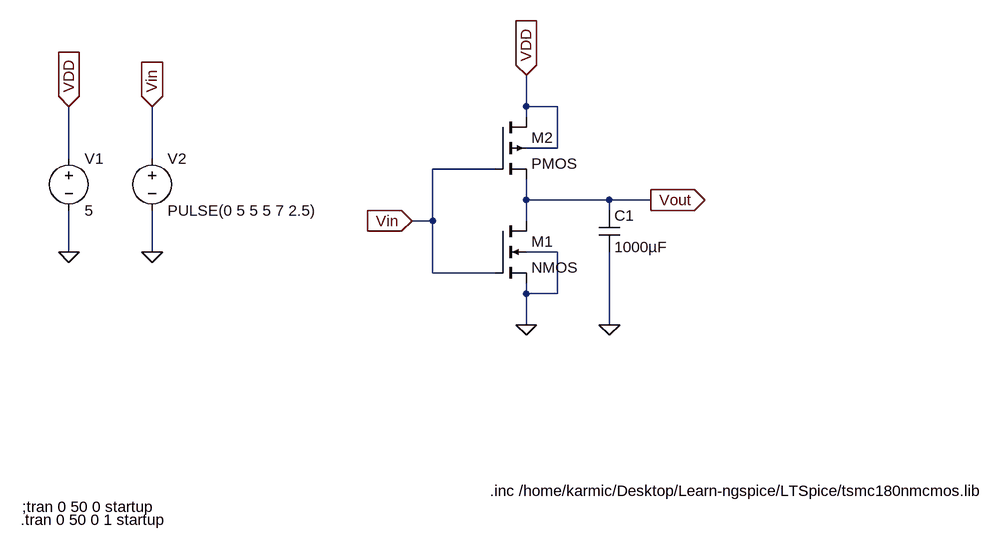
[diagram p0: schematic Inverter.asc]
Inverter.asc, the LTspice schematic file:
Version 4
SHEET 1 1096 680
WIRE 304 -64 304 -112
WIRE 352 -64 304 -64
WIRE 304 -48 304 -64
WIRE 352 0 352 -64
WIRE 352 0 304 0
WIRE -400 16 -400 -64
WIRE -272 16 -272 -64
WIRE 256 32 160 32
WIRE 304 80 304 48
WIRE 432 80 304 80
WIRE 496 80 432 80
WIRE 432 96 432 80
WIRE 160 112 160 32
WIRE 160 112 128 112
WIRE 304 112 304 80
WIRE -400 160 -400 96
WIRE -272 160 -272 96
WIRE 352 160 304 160
WIRE 160 192 160 112
WIRE 256 192 160 192
WIRE 304 224 304 208
WIRE 352 224 352 160
WIRE 352 224 304 224
WIRE 304 272 304 224
WIRE 432 272 432 160
FLAG 304 272 0
FLAG 304 -112 VDD
IOPIN 304 -112 In
FLAG 128 112 Vin
IOPIN 128 112 In
FLAG 432 272 0
FLAG 496 80 Vout
IOPIN 496 80 Out
FLAG -272 160 0
FLAG -400 -64 VDD
IOPIN -400 -64 In
FLAG -272 -64 Vin
IOPIN -272 -64 In
FLAG -400 160 0
SYMBOL nmos4 256 112 R0
SYMATTR InstName M1
SYMBOL pmos4 256 -48 R0
SYMATTR InstName M2
SYMBOL cap 416 96 R0
SYMATTR InstName C1
SYMATTR Value 1000µF
SYMBOL voltage -400 0 R0
WINDOW 123 0 0 Left 0
WINDOW 39 0 0 Left 0
SYMATTR InstName V1
SYMATTR Value 5
SYMBOL voltage -272 0 R0
WINDOW 123 0 0 Left 0
WINDOW 39 0 0 Left 0
SYMATTR InstName V2
SYMATTR Value PULSE(0 5 5 5 7 2.5)
TEXT 248 528 Left 2 !.inc /home/karmic/Desktop/Learn-ngspice/LTSpice/tsmc180nmcmos.lib
TEXT -472 552 Left 2 !;tran 0 50 0 startup
TEXT -474 572 Left 2 !.tran 0 50 0 1 startup

The netlist it stands for:
* Inverter.asc
M1 Vout Vin 0 0 NMOS
M2 VDD Vin Vout VDD PMOS
C1 Vout 0 1000µF
V1 VDD 0 5
V2 Vin 0 PULSE(0 5 5 5 7 2.5)
.model NMOS NMOS
.model PMOS PMOS
.lib standard.mos
.inc /home/karmic/Desktop/Learn-ngspice/LTSpice/tsmc180nmcmos.lib
;tran 0 50 0 startup
.tran 0 50 0 1 startup
.backanno
.end

* Results of the author's LTspice run, read from the files saved beside the schematic
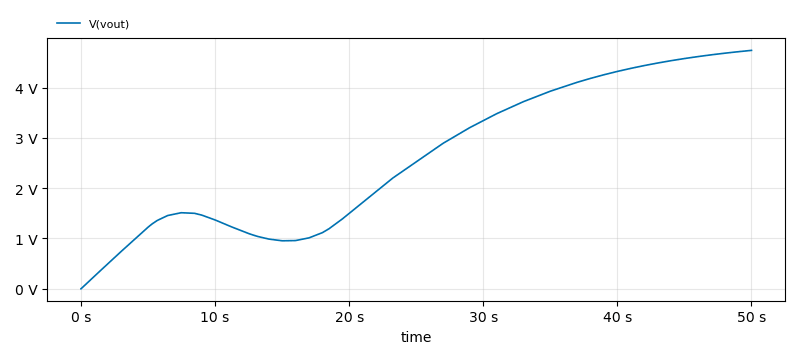
[diagram p1: Transient Analysis of Inverter.asc, plotted from the saved traces]
* Transient Analysis, 1 run:
*   V(vout): min 0 V, max 4.74 V, average 2.619 V, rms 3.008 V, last 4.74 V